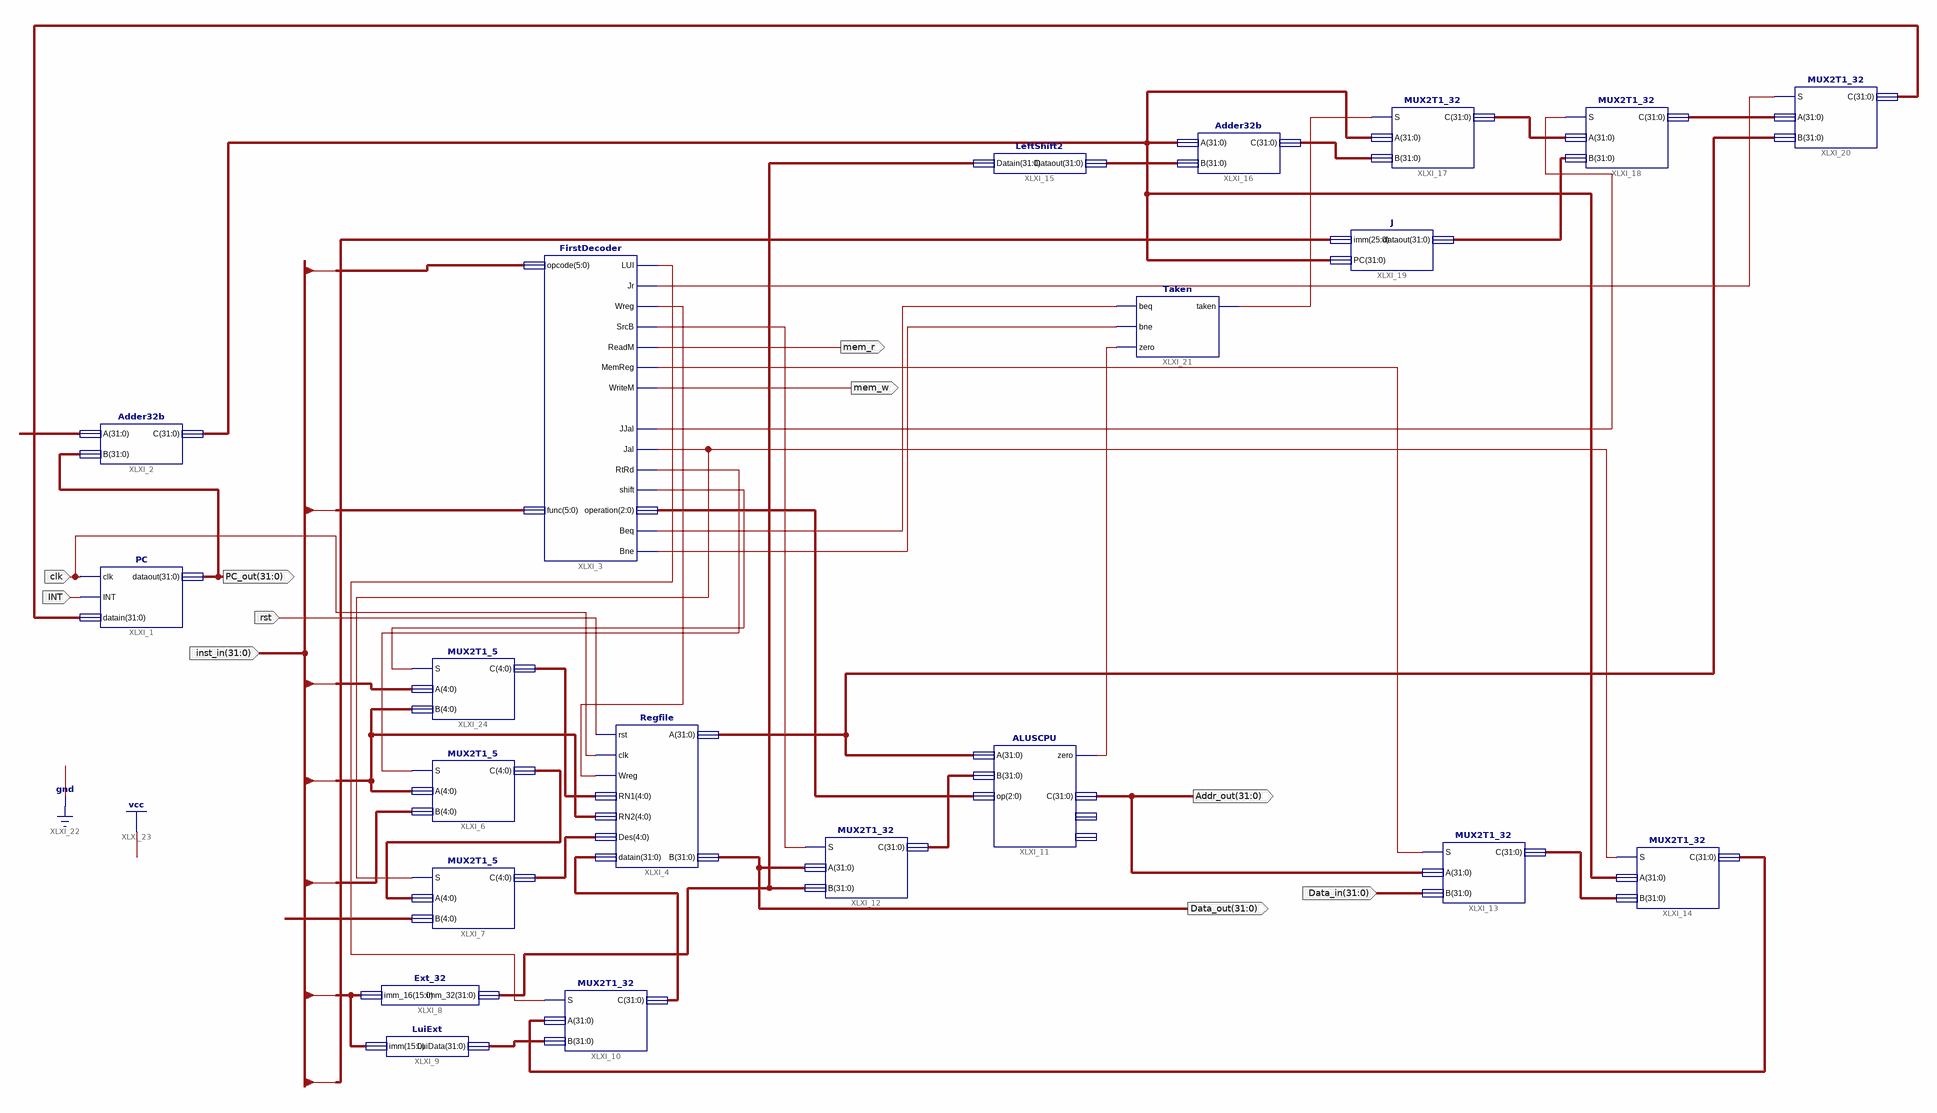
[diagram p0: schematic sheet 1]
// Xilinx ISE schematic SCPU.sch (kintex7) as structural Verilog: 21 symbols, 10 ports
module SCPU (
  input  clk,
  input  INT,
  input  [31:0] inst_in,
  input  rst,
  input  [31:0] Data_in,
  output [31:0] PC_out,
  output [31:0] Data_out,
  output [31:0] Addr_out,
  output mem_r,
  output mem_w
);

  wire XLXN_23, XLXN_29, XLXN_30, XLXN_33, XLXN_34, XLXN_38, XLXN_43, XLXN_52, XLXN_61, XLXN_65, XLXN_68,
       XLXN_71, XLXN_73;
  wire [2:0] XLXN_70;
  wire [4:0] XLXN_11, XLXN_24, XLXN_25;
  wire [31:0] XLXN_15, XLXN_16, XLXN_20, XLXN_22, XLXN_36, XLXN_44, XLXN_48, XLXN_49, XLXN_50, XLXN_51,
       XLXN_53, XLXN_55, XLXN_57, XLXN_59;

  PC XLXI_1 (.clk(clk), .INT(INT), .datain(XLXN_53), .dataout(PC_out));
  Adder32b XLXI_2 (.A(32'b00000000000000000000000000000100), .B(PC_out), .C(XLXN_55));
  FirstDecoder XLXI_3 (
    .opcode(inst_in[31:26]), .func(inst_in[5:0]), .LUI(XLXN_34), .Jr(XLXN_61), .Wreg(XLXN_29),
    .SrcB(XLXN_38), .ReadM(mem_r), .MemReg(XLXN_43), .WriteM(mem_w), .JJal(XLXN_52), .Jal(XLXN_33),
    .RtRd(XLXN_30), .shift(XLXN_23), .operation(XLXN_70), .Beq(XLXN_71), .Bne(XLXN_73));
  Regfile XLXI_4 (
    .rst(rst), .clk(clk), .Wreg(XLXN_29), .RN1(XLXN_24), .RN2(inst_in[20:16]), .Des(XLXN_25),
    .datain(XLXN_22), .A(XLXN_59), .B(Data_out));
  MUX2T1_5 XLXI_6 (.S(XLXN_30), .A(inst_in[20:16]), .B(inst_in[15:11]), .C(XLXN_11));
  MUX2T1_5 XLXI_7 (.S(XLXN_33), .A(XLXN_11), .B({5{1'b1}}), .C(XLXN_25));
  Ext_32 XLXI_8 (.imm_16(inst_in[15:0]), .imm_32(XLXN_16));
  LuiExt XLXI_9 (.imm(inst_in[15:0]), .LuiData(XLXN_15));
  MUX2T1_32 XLXI_10 (.S(XLXN_34), .A(XLXN_20), .B(XLXN_15), .C(XLXN_22));
  ALUSCPU XLXI_11 (.A(XLXN_59), .B(XLXN_36), .op(XLXN_70), .zero(XLXN_68), .C(Addr_out));  // open: S, result1
  MUX2T1_32 XLXI_12 (.S(XLXN_38), .A(Data_out), .B(XLXN_16), .C(XLXN_36));
  MUX2T1_32 XLXI_13 (.S(XLXN_43), .A(Addr_out), .B(Data_in), .C(XLXN_44));
  MUX2T1_32 XLXI_14 (.S(XLXN_33), .A(XLXN_55), .B(XLXN_44), .C(XLXN_20));
  LeftShift2 XLXI_15 (.Datain(XLXN_16), .Dataout(XLXN_48));
  Adder32b XLXI_16 (.A(XLXN_55), .B(XLXN_48), .C(XLXN_49));
  MUX2T1_32 XLXI_17 (.S(XLXN_65), .A(XLXN_55), .B(XLXN_49), .C(XLXN_51));
  MUX2T1_32 XLXI_18 (.S(XLXN_52), .A(XLXN_51), .B(XLXN_50), .C(XLXN_57));
  J XLXI_19 (.imm(inst_in[25:0]), .PC(XLXN_55), .dataout(XLXN_50));
  MUX2T1_32 XLXI_20 (.S(XLXN_61), .A(XLXN_57), .B(XLXN_59), .C(XLXN_53));
  Taken XLXI_21 (.beq(XLXN_71), .bne(XLXN_73), .zero(XLXN_68), .taken(XLXN_65));
  MUX2T1_5 XLXI_24 (.S(XLXN_23), .A(inst_in[25:21]), .B(inst_in[20:16]), .C(XLXN_24));
endmodule
